# Altium schematic sheet TFdat.SchDoc
size A3; PageSetup: Record=PageOptions|CenterHorizontal=True|CenterVertical=True|PrintScale=1.63|XCorrection=1.00|YCorrection=1.00|PrintKind=1|BorderSize=5000000|LeftOffset=0|BottomOffset=0|Orientation=2|PaperLength=1000|PaperWidth=1000|Scale=100|PaperSource=7|PrintQuality=1200|MediaType=1|DitherType=10|PaperKind=A3|PrintScaleMode=1
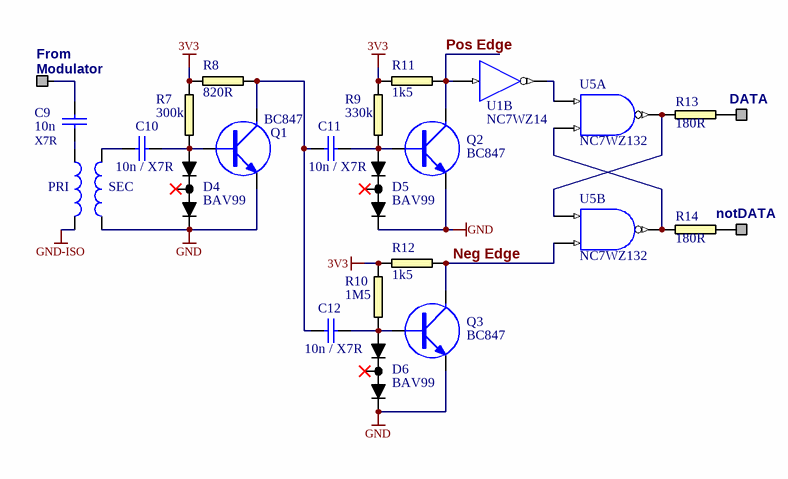
[diagram p0: TFdat.SchDoc]

## Parts
C9  10n  [0603]
C10  10n / X7R  [0603]
C11  10n / X7R  [0603]
C12  10n / X7R  [0603]
D4  BAV99  [SOT-23]
D5  BAV99  [SOT-23]
D6  BAV99  [SOT-23]
L3  PRI  [Planar_PCB_Spiral]  (net tie, no BOM)
L4  SEC  [Planar_PCB_Spiral]  (net tie, no BOM)
PIN5  From Modulator  (value not drawn)
PIN6  DATA
PIN7  notDATA
Q1  BC847  [SOT-23]
Q2  BC847  [SOT-23]
Q3  BC847  [SOT-23]
R7  300k  [0603]
R8  820R  [0603]
R9  330k  [0603]
R10  1M5  [0603]
R11  1k5  [0603]
R12  1k5  [0603]
R13  180R  [0603]
R14  180R  [0603]
U1  NC7WZ14  [SC70]  (part B of 2)
U5  NC7WZ132  [US8_SOT765_MO-187-CA]  (parts A,B of 2)

## Nets
3V3: R7.1 R8.1 R9.1 R10.1 R11.1 R12.1
GND: D4.2 D5.2 D6.2 L4.1 Q1.2(E) Q2.2(E) Q3.2(E)
GND-ISO: L3.1
Neg Edge: Q3.3(C) R12.2 U5.5(2A)
Pos Edge: Q2.3(C) R11.2 U1.3(2A)
NetC9_1: C9.1 L3.2
NetC9_2: C9.2 PIN5.1
NetC10_1: C10.1 L4.2
NetC10_2: C10.2 D4.1 Q1.1(B) R7.2
NetC11_1: C11.1 C12.1 Q1.3(C) R8.2
NetC11_2: C11.2 D5.1 Q2.1(B) R9.2
NetC12_2: C12.2 D6.1 Q3.1(B) R10.2
NetPIN6_1: PIN6.1 R13.2
NetPIN7_1: PIN7.1 R14.2
NetR13_1: R13.1 U5.6(2B) U5.7(1Y)
NetR14_1: R14.1 U5.2(1B) U5.3(2Y)
NetU1_4: U1.4(2~{Y}) U5.1(1A)

Not connected (* = marked no-connect by the designer): D4 3*; D5 3*; D6 3*; U5 4(GND) 8(VCC)

## Notes on the sheet
- (near PIN5) From Modulator
- (in symbol CAP-STD-SM) X7R

## Library data of the parts
C9-C12 = CAP-STD-SM: Capacitor - S/M; Manuf.Code: *
D4-D6 = BAV-99: 3 Pin Dual Diode S/M
L3 L4 = Inductor: Code_IEC: 1005; Value: 10mH; Published: 8-Jun-2000; LatestRevisionDate: 29-May-2009; LatestRevisionNote: IPC-7351 Footprint Added.; PackageReference: 0402-A; Publisher: Altium Limited; PackageDescription: Chip Inductor; Code_JEITA: 0402
PIN5-PIN7 = DAQM_Terminal: Terminal of DAQM Module - may be castellated via or square test pin
Q1-Q3 = BC847: Transistor - Surface Mount Device
R7-R14 = RES-SM: Resistor - S/M
U1 = NC7WZ14: Dual Fast Schmitt Trigger; DK PN: NC7WZ14P6XCT-ND
U5 = NC7WZ132K8X: Dual 2-Input NAND Gates; DK PN: *